# Altium project AirLP.PrjPcb
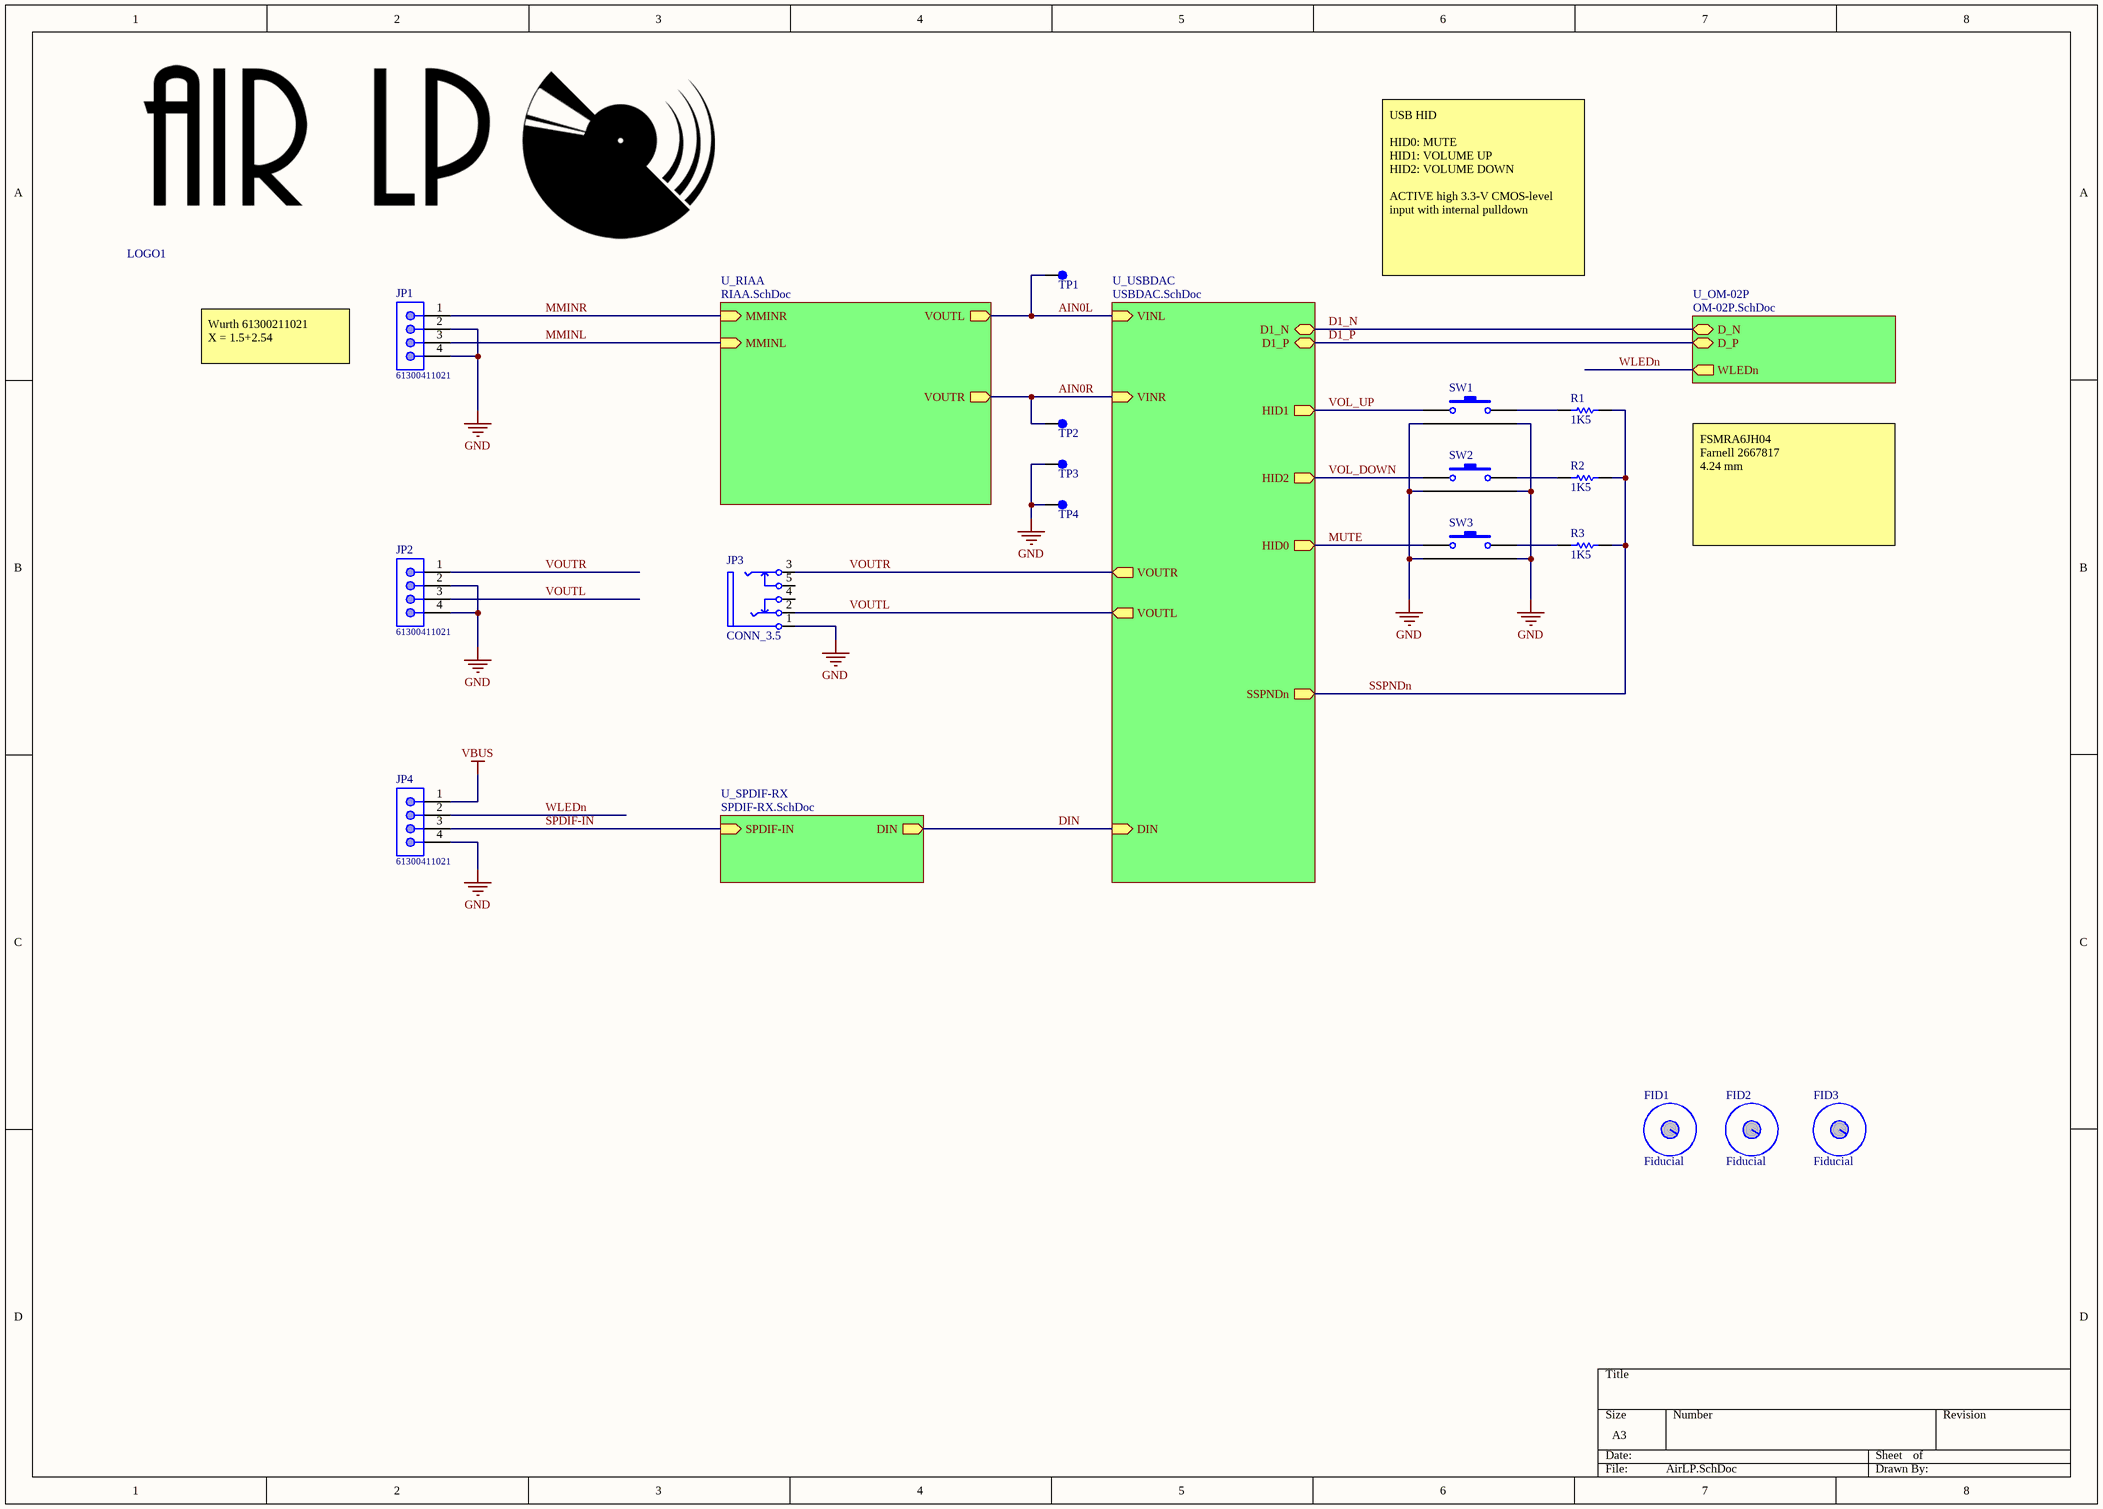
[diagram p0: AirLP.SchDoc]
5 sheets, 142 parts. Net scope: hierarchical (ports join the sheet entries above them; power ports are global).
Board file: AirLP.PcbDoc
Sheets:
  AirLP.SchDoc
    U_RIAA = RIAA.SchDoc
    U_USBDAC = USBDAC.SchDoc
    U_OM-02P = OM-02P.SchDoc
    U_SPDIF-RX = SPDIF-RX.SchDoc

## Sheet AirLP.SchDoc
size A3

### Parts
FID1  Fiducial  [MECH_FID_PLUS]  (no BOM)
FID2  Fiducial  [MECH_FID_PLUS]  (no BOM)
FID3  Fiducial  [MECH_FID_PLUS]  (no BOM)
JP1  61300411021  [61300411021]
JP2  61300411021  [61300411021]
JP3  CONN_3.5  [CONN-3.5_LUMBERG_1503_09]
JP4  61300411021  [61300411021]
LOGO1  LOGO-AIRLP  [LOGO-AIR-LP]  (value not drawn)  (no BOM)
R1  1K5  [RESC0805(2012)_L]
R2  1K5  [RESC0805(2012)_L]
R3  1K5  [RESC0805(2012)_L]
SW1  SW_TACT_FSMRA2JH  [SW_FSMRA2JH]  (value not drawn)
SW2  SW_TACT_FSMRA2JH  [SW_FSMRA2JH]  (value not drawn)
SW3  SW_TACT_FSMRA2JH  [SW_FSMRA2JH]  (value not drawn)
TP1  MECH_Testpoint  [MECH_TP_39_mil]  (value not drawn)  (no BOM)
TP2  MECH_Testpoint  [MECH_TP_39_mil]  (value not drawn)  (no BOM)
TP3  MECH_Testpoint  [MECH_TP_39_mil]  (value not drawn)  (no BOM)
TP4  MECH_Testpoint  [MECH_TP_39_mil]  (value not drawn)  (no BOM)

### Sub-sheets
U_OM-02P = OM-02P.SchDoc: D_P (bidir), D_N (bidir), WLEDn (out)
U_RIAA = RIAA.SchDoc: MMINL (in), MMINR (in), VOUTL (out), VOUTR (out)
U_SPDIF-RX = SPDIF-RX.SchDoc: SPDIF-IN (in), DIN (out)
U_USBDAC = USBDAC.SchDoc: VINL (in), VINR (in), VOUTL (out), VOUTR (out), SSPNDn (out), D1_P (bidir), D1_N (bidir), HID0 (out), HID1 (out), HID2 (out), DIN (in)

### Nets
GND: JP1.2 JP1.4 JP2.2 JP2.4 JP3.1(S) JP4.4 SW1.3 SW1.4 SW2.3 SW2.4 SW3.3 SW3.4 TP3.1(Pin1) TP4.1(Pin1)
VBUS: JP4.1
AIN0L: TP1.1(Pin1) ; sheet U_RIAA/VOUTL, sheet U_USBDAC/VINL
AIN0R: TP2.1(Pin1) ; sheet U_RIAA/VOUTR, sheet U_USBDAC/VINR
D1_N: sheet U_USBDAC/D1_N, sheet U_OM-02P/D_N
D1_P: sheet U_USBDAC/D1_P, sheet U_OM-02P/D_P
DIN: sheet U_USBDAC/DIN, sheet U_SPDIF-RX/DIN
MMINL: JP1.3 ; sheet U_RIAA/MMINL
MMINR: JP1.1 ; sheet U_RIAA/MMINR
MUTE: SW3.1 ; sheet U_USBDAC/HID0
SPDIF-IN: JP4.3 ; sheet U_SPDIF-RX/SPDIF-IN
SSPNDn: R1.2 R2.2 R3.2 ; sheet U_USBDAC/SSPNDn
VOL_DOWN: SW2.1 ; sheet U_USBDAC/HID2
VOL_UP: SW1.1 ; sheet U_USBDAC/HID1
VOUTL: JP2.3 JP3.2(T) ; sheet U_USBDAC/VOUTL
VOUTR: JP2.1 JP3.3(RN) ; sheet U_USBDAC/VOUTR
WLEDn: JP4.2 ; sheet U_OM-02P/WLEDn
NetR1_1: R1.1 SW1.2
NetR2_1: R2.1 SW2.2
NetR3_1: R3.1 SW3.2

Not connected (* = marked no-connect by the designer): JP3 4 5

### Notes on the sheet
- USB HID
  HID0:	MUTE
  HID1:	VOLUME UP
  HID2:	VOLUME DOWN
  ACTIVE high 3.3-V CMOS-level input with internal pulldown
- Wurth 61300211021
  X = 1.5+2.54
- FSMRA6JH04
  Farnell 2667817
  4.24 mm

### Library data of the parts
FID1-FID3 = MECH_FIDUCIAL_PLUS
JP1 JP2 JP4 = 61300411021: THT Angled Pin Header WR-PHD, Pitch 2.54 mm, Single Row, 4 pins; Pin Number: 4; Pitch: 2.54 mm; Gender: Male; Rated Current: 3 A; Working Voltage: 250 VAC; Withstanding Voltage: 500 VAC; Contact Resistance: 20 mOhm; ComponentLink1Description: Manufacturer; ComponentLink1URL: http://www.we-online.de; ComponentLink2Description: Datasheet; ComponentLink2URL: https://katalog.we-online.de/em/datasheet/6130xx11021.pdf; Part Number: 61300411021; Published Date: August 2018; Publisher: Wurth Elektronik; Operating Temperature: -40 to 105 degC; Mounting Technology: THT; Packaging: Bag; Row Number: Single; Orientation: Angled; MPN: 61300411021
JP3 = CONN_3.5_1503_09: Jack Socket, 3.5mm, Thru-Hole, Horizontal, 3-Conductor with Tip open & Ring closed; MPN: 1503 09; ELFA: 300-68-357; Farnell: 1243244
LOGO1 = LOGO-AIRLP: LOGO AIR LP
R1-R3 = RES_1K5_0805: 0805 1.5KΩ ±5% 1/8W; MPN: RC0805JR-071K5L; Power: 125mW; Tolerance: 5%; Value: 1K5
SW1-SW3 = SW_TACT_FSMRA2JH: SWITCH TACTILE SPST-NO 0.05A 12V; ELFA: 35-665-57; DigiKey: 450-1662-ND; Farnell: 1555987; MPN: FSMRA2JH
TP1-TP4 = MECH_Testpoint: Testpoint

## Sheet RIAA.SchDoc
size A3
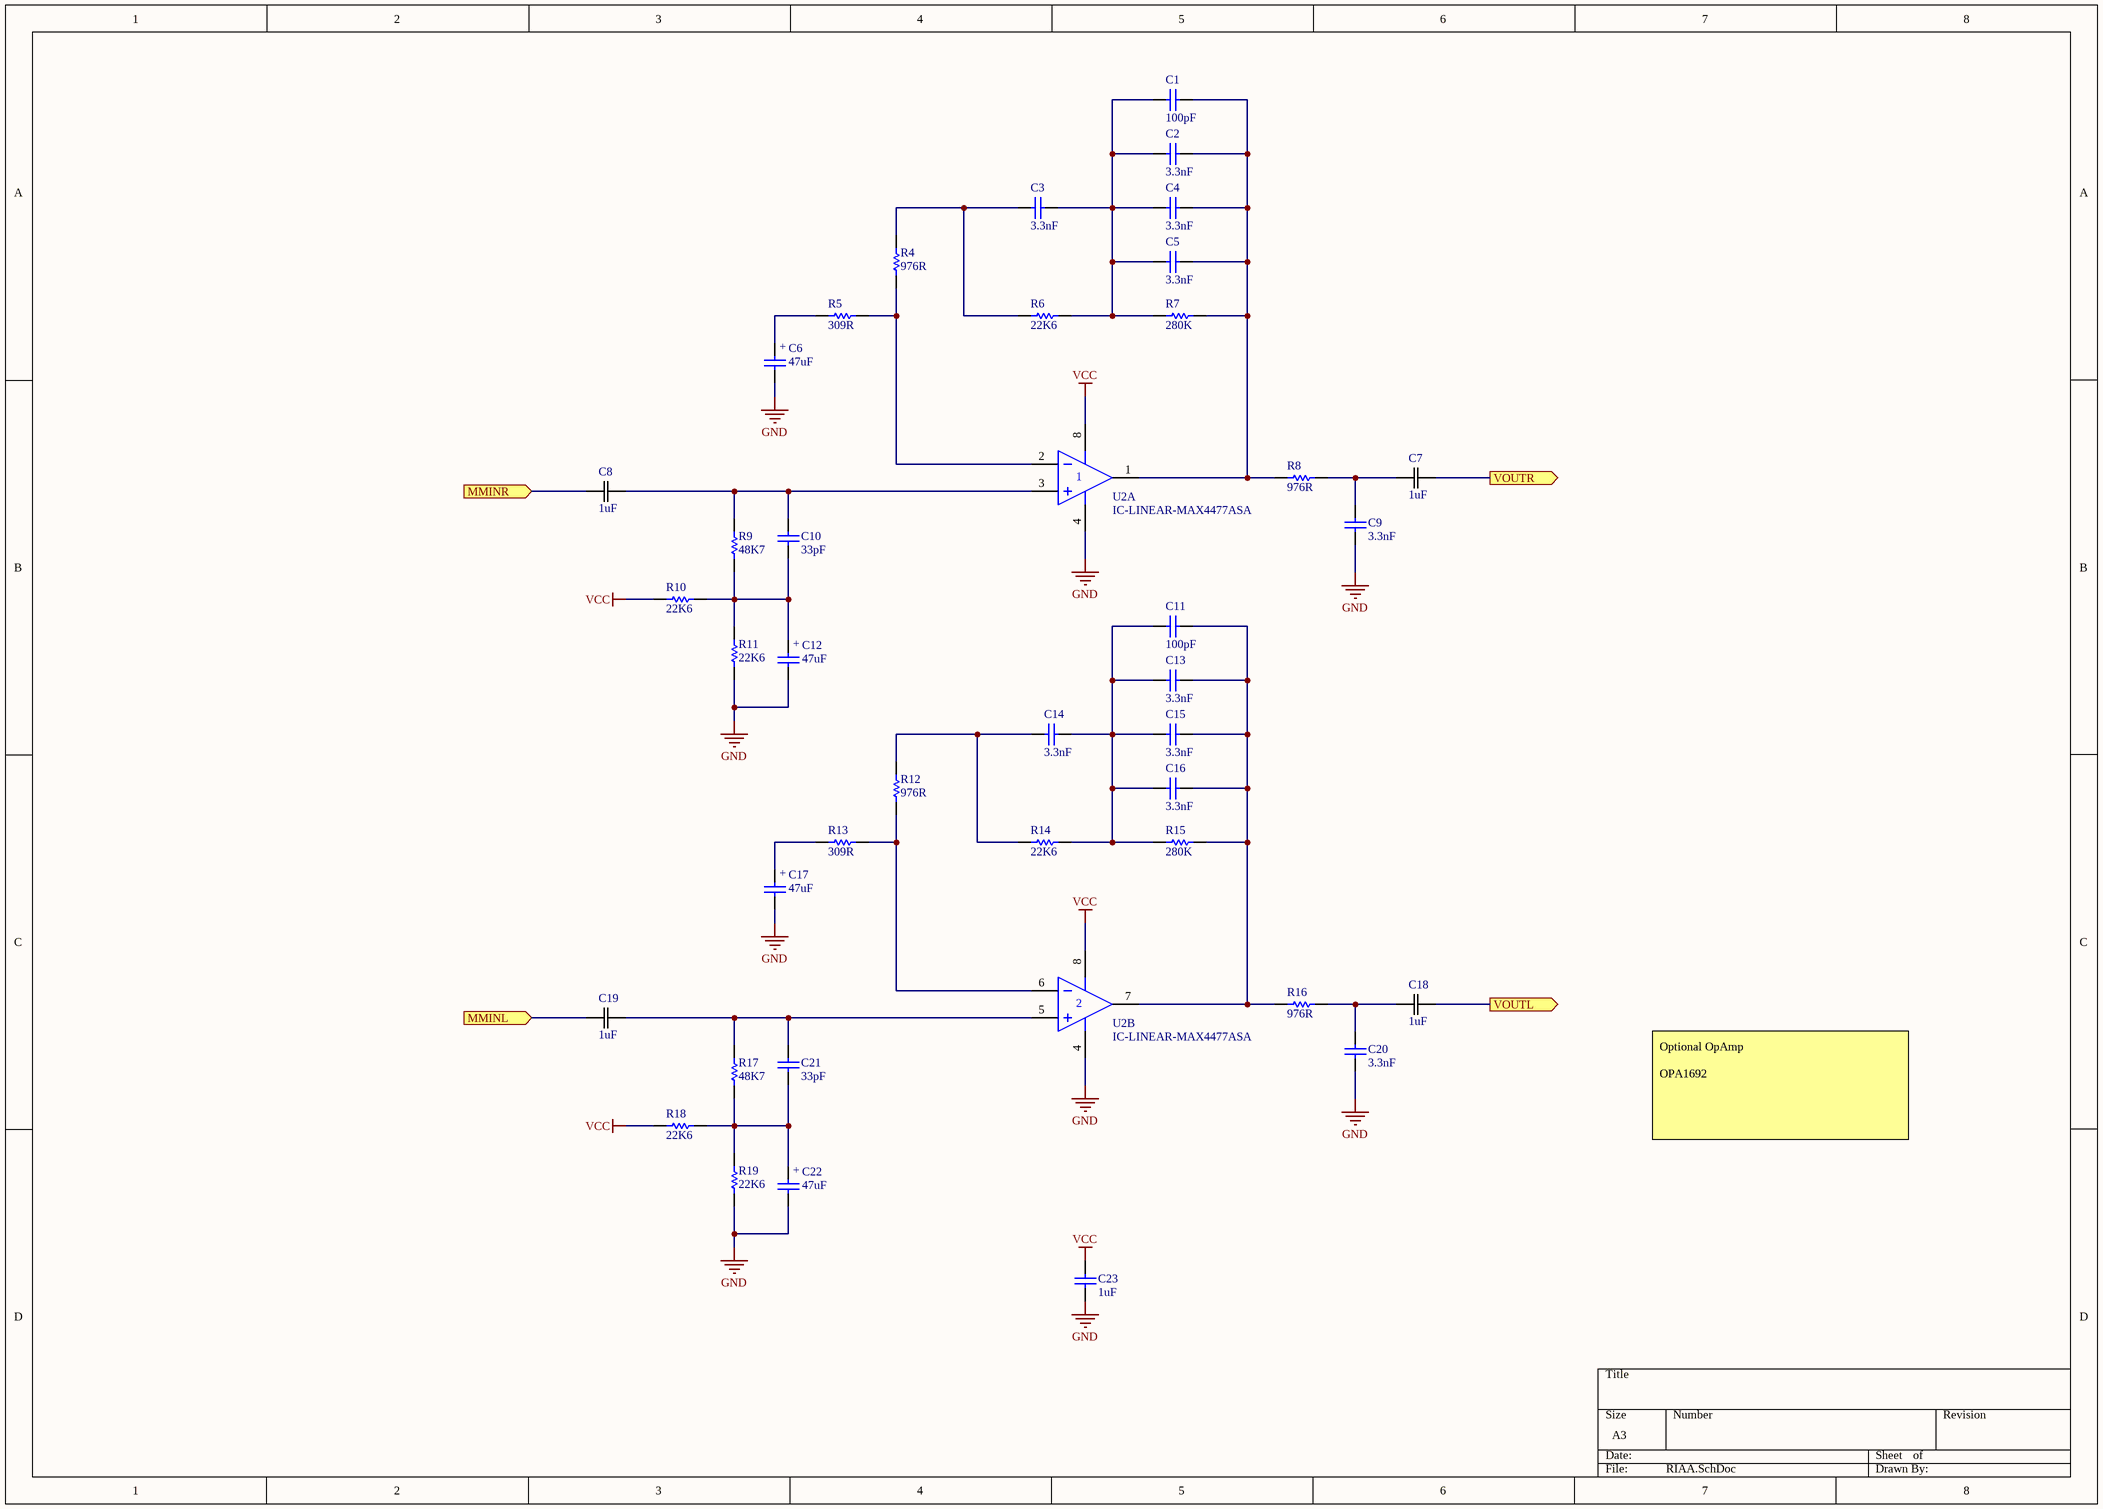
[diagram p1: RIAA.SchDoc]

### Parts
C1  value 100pF  [CAPC0402(1005)33_L]  (hidden comment: 0402CG101J500NT)
C2  value 3.3nF  [CAPC0603(1608)55_L]  (hidden comment: CL10C332JB8NFNC)
C3  value 3.3nF  [CAPC0603(1608)55_L]  (hidden comment: CL10C332JB8NFNC)
C4  value 3.3nF  [CAPC0603(1608)55_L]  (hidden comment: CL10C332JB8NFNC)
C5  value 3.3nF  [CAPC0603(1608)55_L]  (hidden comment: CL10C332JB8NFNC)
C6  value 47uF  [CAPPM3216X180N]  (hidden comment: TAJA476K006RNJ)
C7  1uF  [CAP_ECPU_G2]
C8  1uF  [CAP_ECPU_G2]
C9  value 3.3nF  [CAPC0603(1608)55_L]  (hidden comment: CL10C332JB8NFNC)
C10  value 33pF  [CAPC0402(1005)33_L]  (hidden comment: CC0402JRNPO9BN330)
C11  value 100pF  [CAPC0402(1005)33_L]  (hidden comment: 0402CG101J500NT)
C12  value 47uF  [CAPPM3216X180N]  (hidden comment: TAJA476K006RNJ)
C13  value 3.3nF  [CAPC0603(1608)55_L]  (hidden comment: CL10C332JB8NFNC)
C14  value 3.3nF  [CAPC0603(1608)55_L]  (hidden comment: CL10C332JB8NFNC)
C15  value 3.3nF  [CAPC0603(1608)55_L]  (hidden comment: CL10C332JB8NFNC)
C16  value 3.3nF  [CAPC0603(1608)55_L]  (hidden comment: CL10C332JB8NFNC)
C17  value 47uF  [CAPPM3216X180N]  (hidden comment: TAJA476K006RNJ)
C18  1uF  [CAP_ECPU_G2]
C19  1uF  [CAP_ECPU_G2]
C20  value 3.3nF  [CAPC0603(1608)55_L]  (hidden comment: CL10C332JB8NFNC)
C21  value 33pF  [CAPC0402(1005)33_L]  (hidden comment: CC0402JRNPO9BN330)
C22  value 47uF  [CAPPM3216X180N]  (hidden comment: TAJA476K006RNJ)
C23  value 1uF  [CAPC0402(1005)33_L]  (hidden comment: GRM155R61C105KA12D)
R4  976R  [RESC0402(1005)_L]
R5  309R  [RESC0402(1005)_L]
R6  22K6  [RESC0402(1005)_L]
R7  280K  [RESC0402(1005)_L]
R8  976R  [RESC0402(1005)_L]
R9  48K7  [RESC0402(1005)_L]
R10  22K6  [RESC0402(1005)_L]
R11  22K6  [RESC0402(1005)_L]
R12  976R  [RESC0402(1005)_L]
R13  309R  [RESC0402(1005)_L]
R14  22K6  [RESC0402(1005)_L]
R15  280K  [RESC0402(1005)_L]
R16  976R  [RESC0402(1005)_L]
R17  48K7  [RESC0402(1005)_L]
R18  22K6  [RESC0402(1005)_L]
R19  22K6  [RESC0402(1005)_L]
U2  IC-LINEAR-MAX4477ASA  [SOIC8_N]  (parts A,B of 2)

### Ports
MMINL (in), MMINR (in), VOUTL (out), VOUTR (out)

### Nets
GND: C6.2 C9.1 C12.2 C17.2 C20.1 C22.2 C23.1 R11.2 R19.2 U2.4(V-)
VCC: C23.2 R10.1 R18.1 U2.8(V+)
AIN0L: C18.2 ; port VOUTL
AIN0R: C7.2 ; port VOUTR
MMINL: C19.1 ; port MMINL
MMINR: C8.1 ; port MMINR
NetC1_1: C1.1 C2.1 C3.2 C4.1 C5.1 R6.2 R7.1
NetC1_2: C1.2 C2.2 C4.2 C5.2 R7.2 R8.1 U2.1(OUT1)
NetC3_1: C3.1 R4.1 R6.1
NetC6_1: C6.1 R5.1
NetC7_1: C7.1 C9.2 R8.2
NetC8_2: C8.2 C10.1 R9.1 U2.3(IN1+)
NetC10_2: C10.2 C12.1 R9.2 R10.2 R11.1
NetC11_1: C11.1 C13.1 C14.2 C15.1 C16.1 R14.2 R15.1
NetC11_2: C11.2 C13.2 C15.2 C16.2 R15.2 R16.1 U2.7(OUT2)
NetC14_1: C14.1 R12.1 R14.1
NetC17_1: C17.1 R13.1
NetC18_1: C18.1 C20.2 R16.2
NetC19_2: C19.2 C21.1 R17.1 U2.5(IN2+)
NetC21_2: C21.2 C22.1 R17.2 R18.2 R19.1
NetR4_2: R4.2 R5.2 U2.2(IN1-)
NetR12_2: R12.2 R13.2 U2.6(IN2-)

### Notes on the sheet
- Optional OpAmp
  OPA1692
- (in symbol CAP_47uF_6.3V_1206) +

### Library data of the parts
C1 C11 = CAP_100pF_0402: 0402 100pF ±5% 50V C0G，NP0; Dielectric: C0G; PackageReference: 0402; MPN: 0402CG101J500NT; Voltage: 50V
C2-C5 C9 C13-C16 C20 = CAP_3.3nF_0603: 0603 3.3nF ±5% 50V C0G(NPO) H=0.8mm; PackageReference: 0603; MPN: CL10C332JB8NFNC; Voltage: 50V; Dielectric: C0G
C6 C12 C17 C22 = CAP_47uF_6.3V_1206: 47µF ±10% 6.3V ESR=1.6Ω@100kHz; Dielectric: Tantalum; PackageReference: 1206; MPN: TAJA476K006RNJ; Voltage: 6.3V
C7 C8 C18 C19 = CAP-ECP-U1C105MA5: 1µF Film Capacitor  16V Acrylic, Metallized - Stacked 1210 (3225 Metric); Vendor: Panasonic; Built_By: EMA_UL_Team; Type: DEV; C: Copyright (C) 2015 Accelerated Designs. All rights reserved; MPN: ECP-U1C105MA5; RefDes: RefDes; Value: 1uF
C10 C21 = CAP_33pF_0402: 0402 33PF ±5% 50V NPO; Dielectric: C0G; PackageReference: 0402; MPN: CC0402JRNPO9BN330; Voltage: 50V
C23 = CAP_1uF_0402: 0402 1μF ±10% 16V X5R; Voltage: 10V; PackageReference: 0402; MPN: GRM155R61C105KA12D; Dielectric: X5R
R4 R8 R12 R16 = RES_976R_0402: 0402 976Ω ±1% 1/16W; MPN: 0402WGF9760TCE; Power: 62.5mW; Tolerance: 1%; Value: 976R
R5 R13 = RES_309R_0402: 0402 309Ω ±1% 1/16W; MPN: 0402WGF3090TCE; Power: 62.5mW; Tolerance: 1%; Value: 309R
R6 R10 R11 R14 R18 R19 = RES_22K6_0402: 0402 22.6KΩ ±1% 1/16W; MPN: RC0402FR-0722K6L; Power: 62.5mW; Tolerance: 1%; Value: 22K6
R7 R15 = RES_280K_0402: 0402 280KΩ ±1% 1/16W; MPN: 0402WGF2803TCE; Power: 62.5mW; Tolerance: 1%; Value: 280K
R9 R17 = RES_48K7_0402: 0402 48.7KΩ ±1% 1/16W; MPN: 0402WGF4872TCE; Power: 62.5mW; Tolerance: 1%; Value: 48K7
U2 = IC-LINEAR-MAX4477ASA: Dual Rail-to-Rail output  Low-Power Operational Amplifier; MPN: MAX4477ASA+; Farnell: 1550527

## Sheet USBDAC.SchDoc
size A3
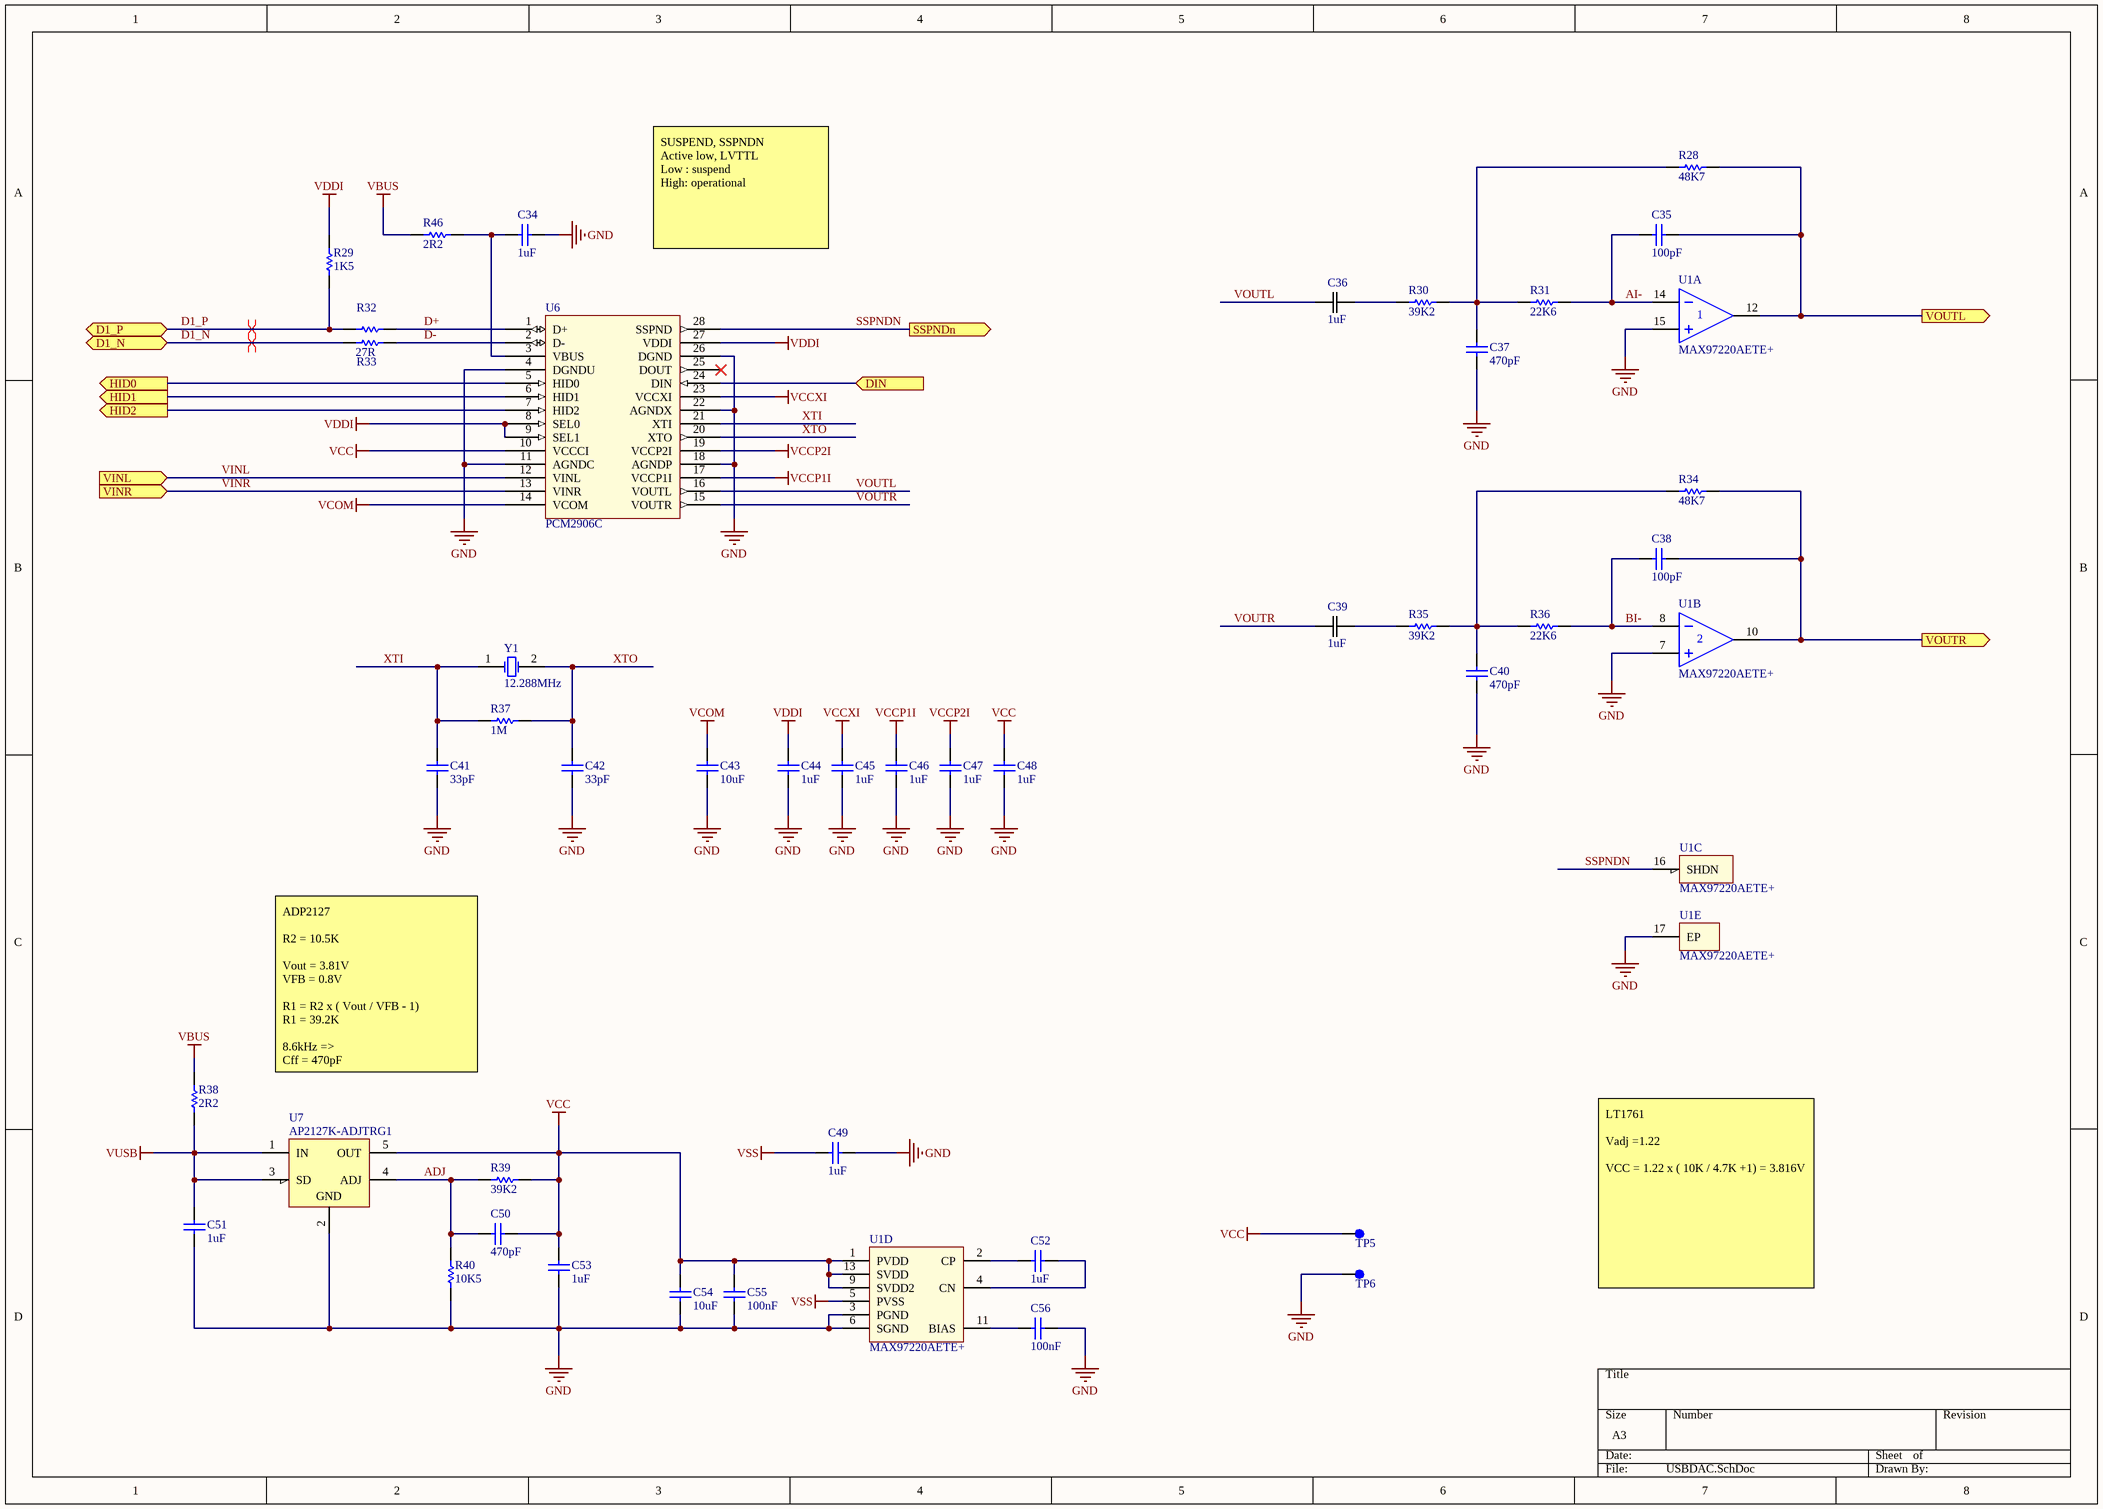
[diagram p2: USBDAC.SchDoc]

### Parts
C34  value 1uF  [CAPC0402(1005)33_L]  (hidden comment: GRM155R61C105KA12D)
C35  value 100pF  [CAPC0402(1005)33_L]  (hidden comment: 0402CG101J500NT)
C36  1uF  [CAP_ECPU_G2]
C37  value 470pF  [CAPC0402(1005)33_L]  (hidden comment: GRM1555C1H471JA01D)
C38  value 100pF  [CAPC0402(1005)33_L]  (hidden comment: 0402CG101J500NT)
C39  1uF  [CAP_ECPU_G2]
C40  value 470pF  [CAPC0402(1005)33_L]  (hidden comment: GRM1555C1H471JA01D)
C41  value 33pF  [CAPC0402(1005)33_L]  (hidden comment: CC0402JRNPO9BN330)
C42  value 33pF  [CAPC0402(1005)33_L]  (hidden comment: CC0402JRNPO9BN330)
C43  value 10uF  [CAPC0603(1608)55_L]  (hidden comment: CL10A106MQ8NNNC)
C44  value 1uF  [CAPC0402(1005)33_L]  (hidden comment: GRM155R61C105KA12D)
C45  value 1uF  [CAPC0402(1005)33_L]  (hidden comment: GRM155R61C105KA12D)
C46  value 1uF  [CAPC0402(1005)33_L]  (hidden comment: GRM155R61C105KA12D)
C47  value 1uF  [CAPC0402(1005)33_L]  (hidden comment: GRM155R61C105KA12D)
C48  value 1uF  [CAPC0402(1005)33_L]  (hidden comment: GRM155R61C105KA12D)
C49  value 1uF  [CAPC0402(1005)33_L]  (hidden comment: GRM155R61C105KA12D)
C50  value 470pF  [CAPC0402(1005)33_L]  (hidden comment: GRM1555C1H471JA01D)
C51  value 1uF  [CAPC0402(1005)33_L]  (hidden comment: GRM155R61C105KA12D)
C52  value 1uF  [CAPC0402(1005)33_L]  (hidden comment: GRM155R61C105KA12D)
C53  value 1uF  [CAPC0402(1005)33_L]  (hidden comment: GRM155R61C105KA12D)
C54  value 10uF  [CAPC0603(1608)55_L]  (hidden comment: CL10A106MQ8NNNC)
C55  value 100nF  [CAPC0402(1005)33_L]  (hidden comment: GRM155R61C104KA88D)
C56  value 100nF  [CAPC0402(1005)33_L]  (hidden comment: GRM155R61C104KA88D)
R28  48K7  [RESC0402(1005)_L]
R29  1K5  [RESC0805(2012)_L]
R30  39K2  [RESC0402(1005)_L]
R31  22K6  [RESC0402(1005)_L]
R32  27R  [RESC0402(1005)_L]  (value not drawn)
R33  27R  [RESC0402(1005)_L]
R34  48K7  [RESC0402(1005)_L]
R35  39K2  [RESC0402(1005)_L]
R36  22K6  [RESC0402(1005)_L]
R37  1M  [RESC0402(1005)_L]
R38  2R2  [RESC0402(1005)_L]
R39  39K2  [RESC0402(1005)_L]
R40  10K5  [RESC0402(1005)_L]
R46  2R2  [RESC0402(1005)_L]
TP5  MECH_Testpoint  [MECH_TP_39_mil]  (value not drawn)  (no BOM)
TP6  MECH_Testpoint  [MECH_TP_39_mil]  (value not drawn)  (no BOM)
U1  MAX97220AETE+  [21-0136I_T1633-4]  (parts A,B,C,D,E of 5)
U6  PCM2906C  [SSOP28_N]
U7  AP2127K-ADJTRG1  [DCK0005A_L]
Y1  value 12.288MHz  [XTAL_SMD_5.0x3.2]  (hidden comment: ABM3-12.288MHZ-D2Y-T)

### Ports
D1_N (bidir), D1_P (bidir), DIN (in), HID0 (out), HID1 (out), HID2 (out), SSPNDn (out), VINL (in), VINR (in), VOUTL (out), VOUTR (out)

### Nets
GND: C34.1 C37.1 C40.1 C41.1 C42.1 C43.1 C44.1 C45.1 C46.1 C47.1 C48.1 C49.1 C51.1 C53.1 C54.1 C55.1 C56.2 R40.1 TP6.1(Pin1) U1.3(PGND) U1.6(SGND) U1.7(IN2+) U1.15(IN1+) U1.17(EP) U6.4(DGNDU) U6.11(AGNDC) U6.18(AGNDP) U6.22(AGNDX) U6.26(DGND) U7.2(GND)
VBUS: R38.2 R46.2
VCC: C48.2 C50.2 C53.2 C54.2 C55.2 R39.2 TP5.1(Pin1) U1.1(PVDD) U1.9(SVDD2) U1.13(SVDD) U6.10(VCCCI) U7.5(OUT)
VCCP1I: C46.2 U6.17(VCCP1I)
VCCP2I: C47.2 U6.19(VCCP2I)
VCCXI: C45.2 U6.23(VCCXI)
VCOM: C43.2 U6.14(VCOM)
VDDI: C44.2 R29.2 U6.8(SEL0) U6.9(SEL1) U6.27(VDDI)
VSS: C49.2 U1.5(PVSS)
VUSB: C51.2 R38.1 U7.1(IN) U7.3(SD)
ADJ: C50.1 R39.1 R40.2 U7.4(ADJ)
AI-: C35.1 R31.2 U1.14(IN1-)
BI-: C38.1 R36.2 U1.8(IN2-)
D1_N: R33.1 ; port D1_N
D1_P: R29.1 R32.1 ; port D1_P
D+: R32.2 U6.1(D+)
D-: R33.2 U6.2(D-)
DIN: U6.24(DIN) ; port DIN
MUTE: U6.5(HID0) ; port HID0
SSPNDn: U1.16(SHDN) U6.28(SSPND) ; port SSPNDn
VINL: U6.12(VINL) ; port VINL  [project net AIN0L]
VINR: U6.13(VINR) ; port VINR  [project net AIN0R]
VOL_DOWN: U6.7(HID2) ; port HID2
VOL_UP: U6.6(HID1) ; port HID1
VOUTL: C35.2 R28.2 U1.12(OUT1) ; port VOUTL
VOUTL: C36.1 U6.16(VOUTL)  [a separate net that carries the same name]
VOUTR: C38.2 R34.2 U1.10(OUT2) ; port VOUTR
VOUTR: C39.1 U6.15(VOUTR)  [a separate net that carries the same name]
XTI: C41.2 R37.1 U6.21(XTI) Y1.1(OSC1)
XTO: C42.2 R37.2 U6.20(XTO) Y1.2(OSC2)
NetC34_2: C34.2 R46.1 U6.3(VBUS)
NetC36_2: C36.2 R30.1
NetC37_2: C37.2 R28.1 R30.2 R31.1
NetC39_2: C39.2 R35.1
NetC40_2: C40.2 R34.1 R35.2 R36.1
NetC52_1: C52.1 U1.4(CN)
NetC52_2: C52.2 U1.2(CP)
NetC56_1: C56.1 U1.11(BIAS)

Not connected (* = marked no-connect by the designer): U6 25(DOUT)*

### Layout directives
differential pair: D1_N, D1_P

### Notes on the sheet
- SUSPEND, SSPNDN
  Active low, LVTTL
  Low : suspend
  High: operational
- ADP2127
  R2 = 10.5K
  Vout = 3.81V
  VFB = 0.8V
  R1 = R2 x ( Vout / VFB - 1)
  R1 = 39.2K
  8.6kHz =>
  Cff = 470pF
- LT1761
  Vadj =1.22
  VCC = 1.22 x ( 10K / 4.7K +1) = 3.816V

### Library data of the parts
C34 C44-C49 C51-C53 = CAP_1uF_0402: 0402 1μF ±10% 16V X5R; Voltage: 10V; PackageReference: 0402; MPN: GRM155R61C105KA12D; Dielectric: X5R
C35 C38 = CAP_100pF_0402: as C1 on sheet RIAA; PackageReference: 0402; MPN: 0402CG101J500NT; Voltage: 50V
C36 C39 = CAP-ECP-U1C105MA5: as C7 on sheet RIAA; MPN: ECP-U1C105MA5; RefDes: RefDes; Value: 1uF
C37 C40 C50 = CAP_470pF_0402: 0402 470pF ±5% 50V C0G; PackageReference: 0402; MPN: GRM1555C1H471JA01D; Voltage: 50V; Dielectric: C0G
C41 C42 = CAP_33pF_0402: 0402 33PF ±5% 50V NPO; Dielectric: C0G; PackageReference: 0402; MPN: CC0402JRNPO9BN330; Voltage: 50V
C43 C54 = CAP_10uF_0603: 0603 10uF ±20% 6.3V X5R H=0.8mm; Voltage: 10V; PackageReference: 0603; MPN: CL10A106MQ8NNNC; Dielectric: X5R
C55 C56 = CAP_100nF_0402: 0402 100nF ±10% 16V X5R; PackageReference: 0402; MPN: GRM155R61C104KA88D; Voltage: 16V; Dielectric: X5R
R28 R34 = RES_48K7_0402: as R9 on sheet RIAA; Tolerance: 1%; Value: 48K7
R29 = RES_1K5_0805: as R1 on sheet AirLP; Tolerance: 5%; Value: 1K5
R30 R35 R39 = RES_39K2_0402: 0402 39.2KΩ ±1% 1/16W; MPN: RC0402FR-0739K2L; Power: 62.5mW; Tolerance: 1%; Value: 39K2
R31 R36 = RES_22K6_0402: as R6 on sheet RIAA; Tolerance: 1%; Value: 22K6
R32 R33 = RES_27R_0402: 0402 27Ω ±1% 1/16W; MPN: RC0402FR-0727RL; Power: 62.5mW; Tolerance: 1%; Value: 27R
R37 = RES_1M_0402: 0402 1MΩ ±1% 1/16W; MPN: RC0402FR-071ML; Power: 62.5mW; Tolerance: 1%; Value: 1M
R38 R46 = RES_2R2_0402: 0402 2.2Ω ±1% 1/16W; MPN: 0402WGF220KTCE; Power: 62.5mW; Tolerance: 1%; Value: 2R2
R40 = RES_10K5_0402: 0402 10.5KΩ ±1% 1/16W; MPN: RC0402FR-0710K5L; Power: 62.5mW; Tolerance: 1%; Value: 10K5
TP5 TP6 = MECH_Testpoint: Testpoint
U1 = MAX97220AETE+: Differential Input DirectDrive Line Drivers/Headphone Amplifiers; MPN: MAX97220AETE+T; Farnell: 2516953; DigiKey: MAX97220AETE+TCT-ND
U6 = IC-AUDIO-PCM2906C: IC STEREO AUD CODEC W/USB 28SSOP; MPN: PCM2906CDB
U7 = AP2127K-ADJTRG1: 300mA HIGH SPEED, EXTREMELY LOW NOISE CMOS LDO REGULATOR; Manufacturer: Diodes Inc; Vin(Max)(V): 5.5; Iq(Typ)(mA): 0.06; Vdo(Typ)(mV): 170; Vout Adj(Min)(V): 0.8; Eco-Plan: Green (RoHS & no Sb/Br); Accuracy(%): 2; Iout(Max)(A): 0.3; Vout Adj(Max)(V): 5.0; Vin(Min)(V): 2.5; SubFamily: Single Channel LDO; PackageVersion: 4093553-3/G; Code_JEDEC: MO-203; ComponentLink2Description: Datasheet; ComponentLink1URL: http://www.ti.com/; ComponentLink3Description: Package Specification; ComponentLink2URL: http://www.ti.com/general/docs/lit/getliterature.tsp?genericPartNumber=TPS71701&fileType=pdf; MPN: AP2127K-ADJTRG1; Mounting Technology: Surface Mount; ComponentLink1Description: Manufacturer URL; ComponentLink3URL: http://www.ti.com/litv/pdf/mpds025f; PackageDescription: 5-Pin Plastic Small-Outline, Body 2 x 1.25 mm, Pitch 0.65 mm; PackageReference: DCK0005A
Y1 = XTAL_12.288MHz_ABM3-12.288MHZ-D2Y-T: CRYSTAL 12.288MHZ 18PF SMD; Farnell: 1368769; MPN: ABM3-12.288MHZ-D2Y-T; DigiKey: 535-10635-1-ND

## Sheet OM-02P.SchDoc
size A3
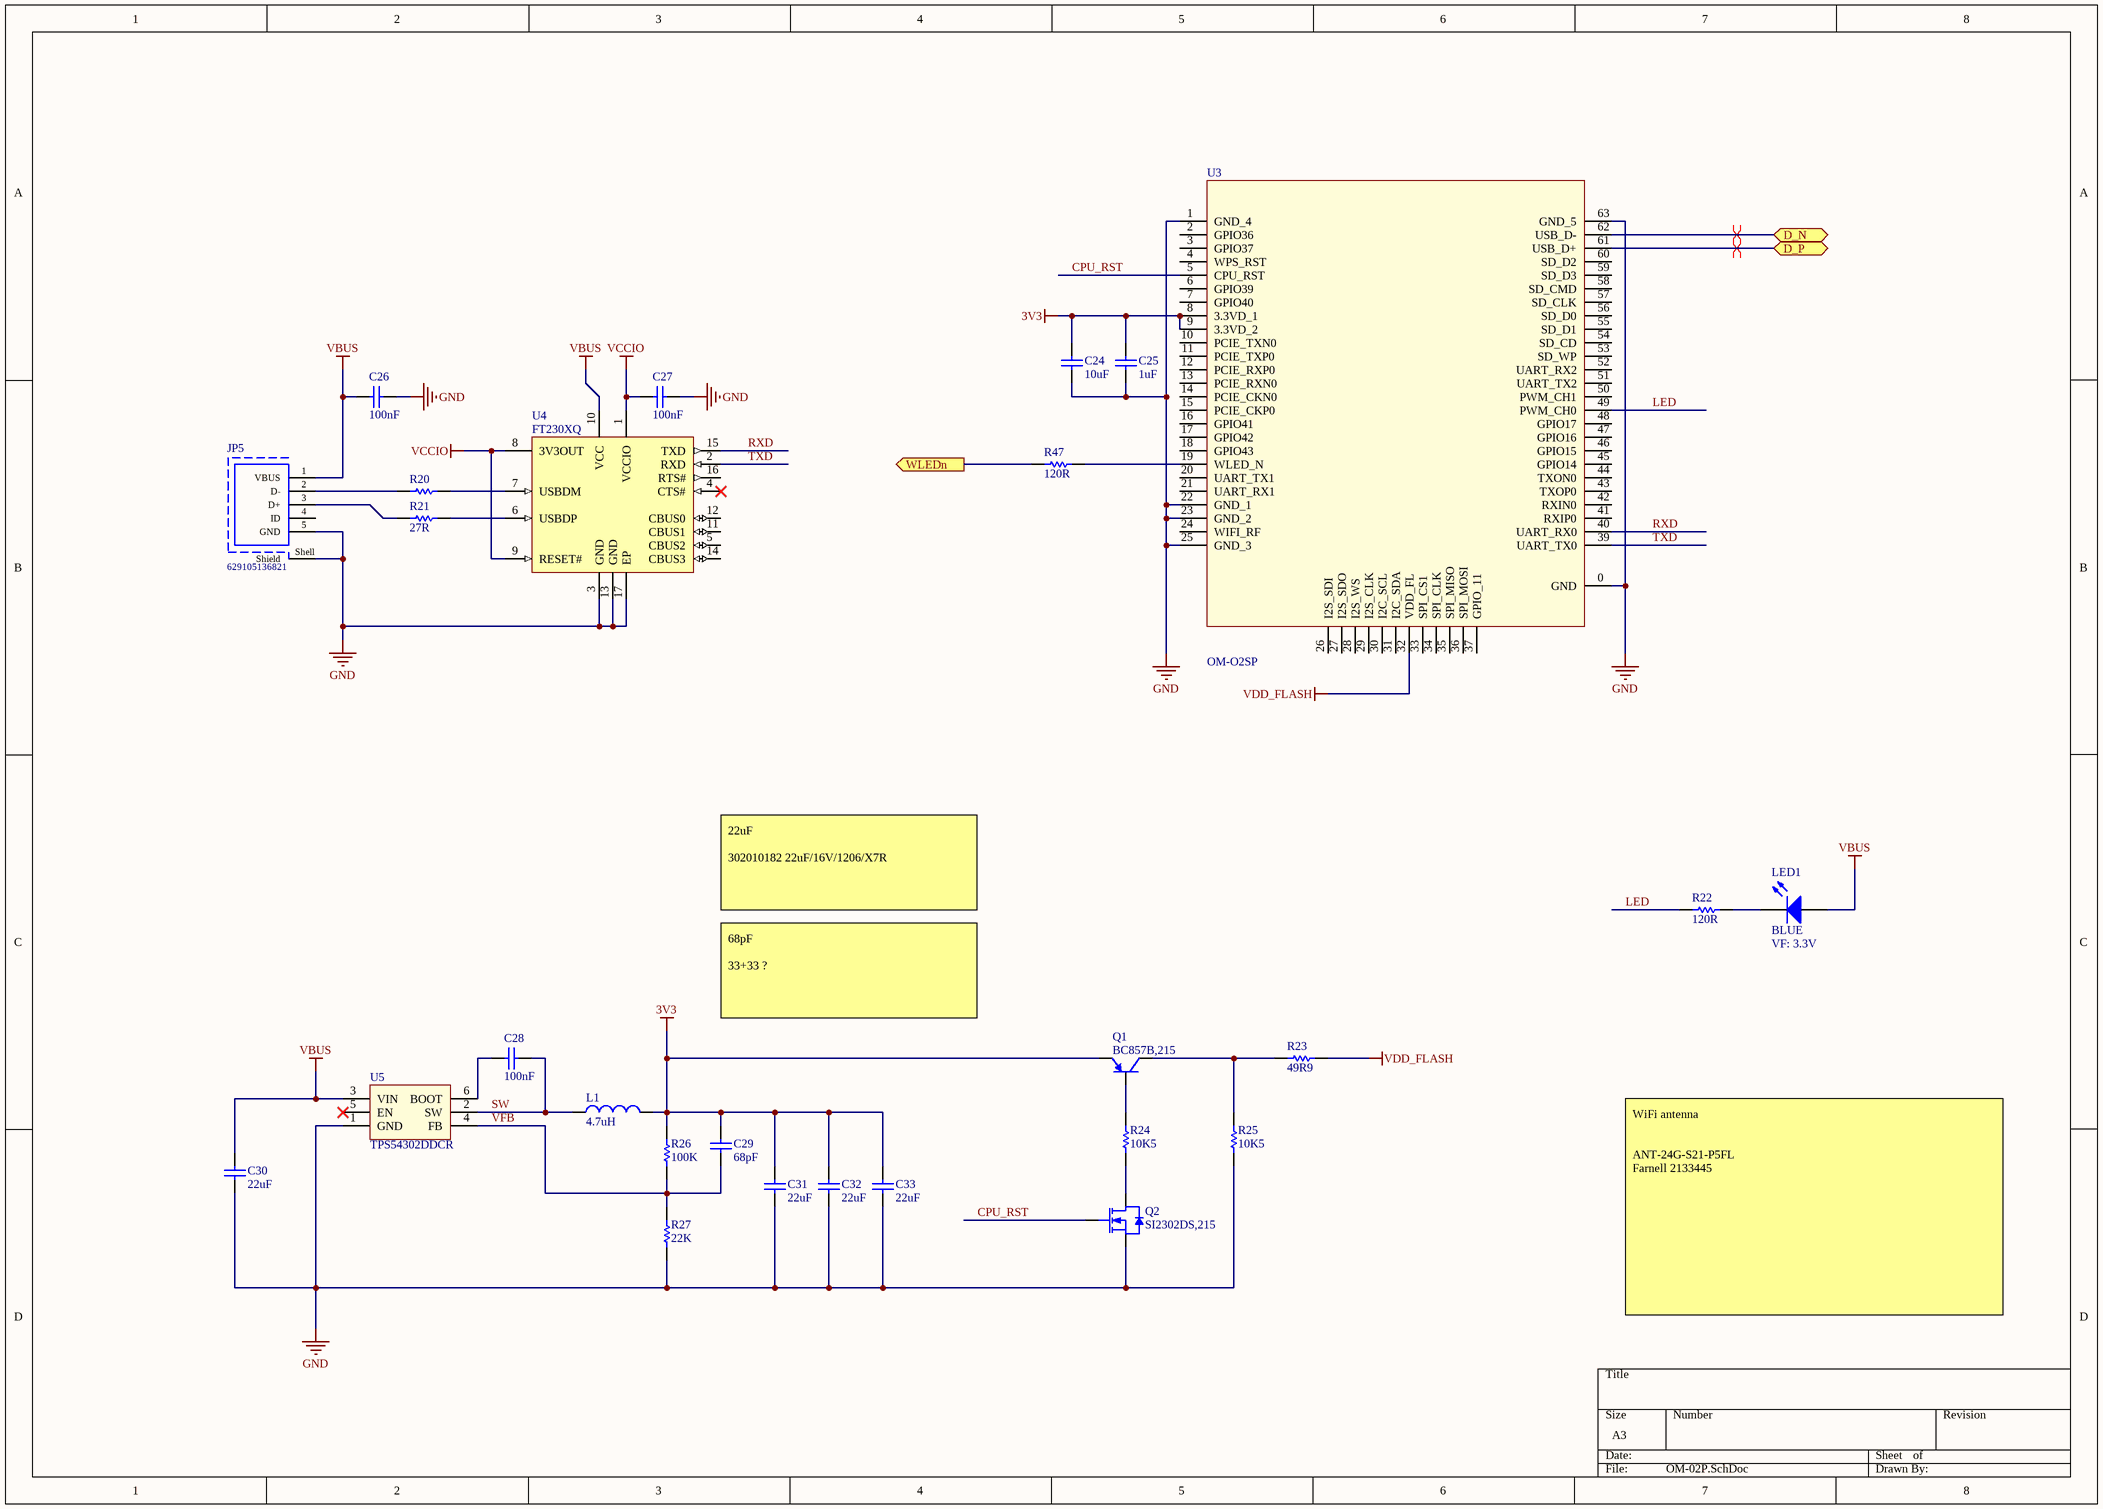
[diagram p3: OM-02P.SchDoc]

### Parts
C24  value 10uF  [CAPC0603(1608)55_L]  (hidden comment: CL10A106MQ8NNNC)
C25  value 1uF  [CAPC0402(1005)33_L]  (hidden comment: GRM155R61C105KA12D)
C26  value 100nF  [CAPC0402(1005)33_L]  (hidden comment: GRM155R61C104KA88D)
C27  value 100nF  [CAPC0402(1005)33_L]  (hidden comment: GRM155R61C104KA88D)
C28  value 100nF  [CAPC0402(1005)33_L]  (hidden comment: GRM155R61C104KA88D)
C29  value 68pF  [CAPC0402(1005)33_L]  (hidden comment: GRM1555C1H680JA01D)
C30  value 22uF  [CAPC1206(3216)75_L]  (hidden comment: CL31A226KOHNNNE)
C31  value 22uF  [CAPC1206(3216)75_L]  (hidden comment: CL31A226KOHNNNE)
C32  value 22uF  [CAPC1206(3216)75_L]  (hidden comment: CL31A226KOHNNNE)
C33  value 22uF  [CAPC1206(3216)75_L]  (hidden comment: CL31A226KOHNNNE)
JP5  629105136821  [629105136821]
L1  value 4.7uH  [L_6045]  (hidden comment: SWPA6045S4R7MT)
LED1  BLUE  VF: 3.3V  [LED_APA3010x]
Q1  BC857B,215  [NXP-SOT23_L]
Q2  SI2302DS,215  [NXP-SOT23_L]
R20  27R  [RESC0402(1005)_L]  (value not drawn)
R21  27R  [RESC0402(1005)_L]
R22  120R  [RESC0402(1005)_L]
R23  49R9  [RESC0402(1005)_L]
R24  10K5  [RESC0402(1005)_L]
R25  10K5  [RESC0402(1005)_L]
R26  100K  [RESC0402(1005)_L]
R27  22K  [RESC0402(1005)_L]
R47  120R  [RESC0402(1005)_L]
U3  OM-O2SP  [CPU-OM-O2S]
U4  FT230XQ  [QFN-16_N]
U5  TPS54302DDCR  [FAIR-MA06A_V]

### Ports
D_N (bidir), D_P (bidir), WLEDn (out)

### Nets
3V3: C24.2 C25.2 C29.2 C31.2 C32.2 C33.2 L1.2 Q1.2(E) R26.2 U3.8(3.3VD_1) U3.9(3.3VD_2)
GND: C24.1 C25.1 C26.2 C27.2 C30.1 C31.1 C32.1 C33.1 JP5.5(GND) JP5.Shell(Shield) Q2.2(S) R25.1 R27.1 U3.0(GND) U3.1(GND_4) U3.22(GND_1) U3.23(GND_2) U3.25(GND_3) U3.63(GND_5) U4.3(GND) U4.13(GND) U4.17(EP) U5.1(GND)
VBUS: C26.1 C30.2 JP5.1(VBUS) LED1.2(A) U4.10(VCC) U5.3(VIN)
VCCIO: C27.1 U4.1(VCCIO) U4.8(3V3OUT) U4.9(RESET#)
VDD_FLASH: R23.2 U3.32(VDD_FL)
CPU_RST: Q2.1(G) U3.5(CPU_RST)
D1_N: U3.62(USB_D-) ; port D_N
D1_P: U3.61(USB_D+) ; port D_P
LED: R22.1 U3.49(PWM_CH0)
RXD: U3.40(UART_RX0) U4.15(TXD)
SW: C28.2 L1.1 U5.2(SW)
TXD: U3.39(UART_TX0) U4.2(RXD)
VFB: C29.1 R26.1 R27.2 U5.4(FB)
WLEDn: R47.1 ; port WLEDn
NetC28_1: C28.1 U5.6(BOOT)
NetJP5_2: JP5.2(D-) R20.1
NetJP5_3: JP5.3(D+) R21.1
NetLED1_1: LED1.1(K) R22.2
NetQ1_1: Q1.1(B) R24.2
NetQ1_3: Q1.3(C) R23.1 R25.2
NetQ2_3: Q2.3(D) R24.1
NetR20_2: R20.2 U4.7(USBDM)
NetR21_2: R21.2 U4.6(USBDP)
NetR47_2: R47.2 U3.19(WLED_N)

Not connected (* = marked no-connect by the designer): JP5 4(ID); U3 2(GPIO36) 3(GPIO37) 4(WPS_RST) 6(GPIO39) 7(GPIO40) 10(PCIE_TXN0) 11(PCIE_TXP0) 12(PCIE_RXP0) 13(PCIE_RXN0) 14(PCIE_CKN0) 15(PCIE_CKP0) 16(GPIO41) 17(GPIO42) 18(GPIO43) 20(UART_TX1) 21(UART_RX1) 24(WIFI_RF) 26(I2S_SDI) 27(I2S_SDO) 28(I2S_WS) 29(I2S_CLK) 30(I2C_SCL) 31(I2C_SDA) 33(SPI_CS1) 34(SPI_CLK) 35(SPI_MISO) 36(SPI_MOSI) 37(GPIO_11) 41(RXIP0) 42(RXIN0) 43(TXOP0) 44(TXON0) 45(GPIO14) 46(GPIO15) 47(GPIO16) 48(GPIO17) 50(PWM_CH1) 51(UART_TX2) 52(UART_RX2) 53(SD_WP) 54(SD_CD) 55(SD_D1) 56(SD_D0) 57(SD_CLK) 58(SD_CMD) 59(SD_D3) 60(SD_D2); U4 4(CTS#)* 5(CBUS2) 11(CBUS1) 12(CBUS0) 14(CBUS3) 16(RTS#); U5 5(EN)*

### Layout directives
differential pair: D1_N, D1_P

### Notes on the sheet
- 22uF
  302010182 22uF/16V/1206/X7R
- 68pF
  33+33 ?
- WiFi antenna
  ANT-24G-S21-P5FL
  Farnell 2133445

### Library data of the parts
C24 = CAP_10uF_0603: as C43 on sheet USBDAC; PackageReference: 0603; MPN: CL10A106MQ8NNNC; Dielectric: X5R
C25 = CAP_1uF_0402: 0402 1μF ±10% 16V X5R; Voltage: 10V; PackageReference: 0402; MPN: GRM155R61C105KA12D; Dielectric: X5R
C26-C28 = CAP_100nF_0402: 0402 100nF ±10% 16V X5R; PackageReference: 0402; MPN: GRM155R61C104KA88D; Voltage: 16V; Dielectric: X5R
C29 = CAP_68pF_0402: 0402 68pF ±5% 50V C0G; PackageReference: 0402; MPN: GRM1555C1H680JA01D; Voltage: 50V; Dielectric: C0G
C30-C33 = CAP_22uF_16V_1206: 1206 22uF ±10% 16V X5R; PackageReference: 1206; MPN: CL31A226KOHNNNE; Voltage: 16V; Dielectric: X5R
JP5 = 629105136821: Micro USB 2.0 Type B Receptacle WR-COM, Horizontal, SMT, with Pads and Pegs; Rated Current: 1 A; Contact Resistance: 30 mOhm; Working Voltage: 30 VAC; ComponentLink1Description: Manufacturer; ComponentLink1URL: http://www.we-online.de; ComponentLink2Description: Datasheet; ComponentLink2URL: https://katalog.we-online.de/em/datasheet/629105136821.pdf; Part Number: 629105136821; Published Date: September 2018; Publisher: Wurth Elektronik; Orientation: Horizontal; Connector Type: Micro USB 2.0 Type B; Operating Temperature: -40 to 105 degC; Mounting Technology: SMT; Gender: Receptacle; Packaging: Tape and Reel; MPN: 629105136821
L1 = L_4.7uH_6045: 6.0*6.0*4.5 4.7μH ±20% 5.50A DCR=0.034 SRF=24MHz; MPN: SWPA6045S4R7MT
LED1 = LED-BLUE-APA3010QBC/D-GX: LED BLUE; VALUE: BLUE; MPN: APA3010QBC/D-GX
Q1 = BC857: PNP,Vce=45V,Ic=0.1A,hfe=220~475; Manufacturer: Infineon; Ptot (max): 330Â mW; fT (typ): 250Â MHz; VCBO (max): 50Â V; ICM (max): 200Â mA; Green: TRUE; VCEO (max): 45Â V; VEBO (max): 5Â V; ICBO (max): 15Â nA; IC (max): 100Â mA; Packing: Reel; ComponentLink2Description: Datasheet; MPN: BC857B,215; PackageReference: SOT23; ComponentLink1URL: http://www.infineon.com/; IBM (max): 200Â mA; PackageDescription: 3-Pin Small Outline Transistor Package, 1.3 x 2.9 mm Body, 0.95 mm Pitch; ComponentLink3URL: http://www.infineon.com/dgdl/SOT23-Package_Overview.pdf?folderId=db3a30431936bc4b0119532290053c66&fileId=db3a30431936bc4b0119533468123c85; ComponentLink3Description: Package Specification; Mounting Technology: Surface Mount; ComponentLink1Description: Manufacturer URL; PackageVersion: Apr-08; Polarity: PNP; ComponentLink2URL: http://www.infineon.com/dgdl/bc857series_bc858series_bc859series_bc860series.pdf?folderId=db3a304314dca389011541d30fa21656&fileId=db3a304314dca389011541da0e3a1661
Q2 = SI2302: N-Channel Enhancement Mode Field-Effect Transistor, 20 V, 2.5 A, 3-Pin SOT23, Tape and Reel; Manufacturer: NXP Semiconductors; MPN: SI2302CDS-T1-GE3; Ciss [typ] (pF): 230; VDS [max] (V): 20; Channel Type: N; Coss [typ] (pF): 125; ID [max] (A): 2.5; Packing: Tape & Reel; DatasheetVersion: Rev. 02; PackageVersion: 06-03-16, 03/2006; Code_JEDEC: TO-236AB; ComponentLink3Description: Package Specification; ComponentLink2URL: http://www.nxp.com/documents/data_sheet/SI2302DS.pdf; PackageDescription: 3-Pin Small Outline Transistor Package, Body 2.9 x 1.3 mm, Pitch 0.95 mm; ComponentLink2Description: Datasheet; ComponentLink1Description: Manufacturer URL; Mounting Technology: Surface Mount; ComponentLink1URL: http://www.nxp.com/; ComponentLink3URL: http://www.nxp.com/documents/outline_drawing/sot023_po.pdf; PackageReference: SOT23
R20 R21 = RES_27R_0402: as R32 on sheet USBDAC; Tolerance: 1%; Value: 27R
R22 R47 = RES_120R_0402: 0402 120Ω ±1% 1/16W; MPN: RC0402FR-07120RL; Power: 62.5mW; Tolerance: 1%; Value: 120R
R23 = RES_49R9_0402: 0402 49.9Ω ±1% 1/16W; MPN: RC0402FR-0749R9L; Power: 62.5mW; Tolerance: 1%; Value: 49R9
R24 R25 = RES_10K5_0402: as R40 on sheet USBDAC; Tolerance: 1%; Value: 10K5
R26 = RES_100K_0402: 0402 100KΩ ±1% 1/16W; MPN: RC0402FR-07100KL; Power: 62.5mW; Tolerance: 1%; Value: 100K
R27 = RES_22K_0402: 0402 22KΩ ±1% 1/16W; MPN: RC0402FR-0722KL; Power: 62.5mW; Tolerance: 1%; Value: 22K
U3 = CPU-OM-O2SP: Onion Omega2S; MPN: OM-O2SP; Mouser: 353-OM-O2SP
U4 = IC-COM-USB-FT230XQ-SQ17: USB Bridge, USB to UART USB 2.0 UART Interface 16-QFN (4x4); MPN: FT230XQ-R
U5 = TPS54302DDCR: Buck Switching Regulator IC Positive Adjustable 0.596V 1 Output 3A SOT-23-6 Thin, TSOT-23-6; MPN: TPS54302DDCR

## Sheet SPDIF-RX.SchDoc
size A3
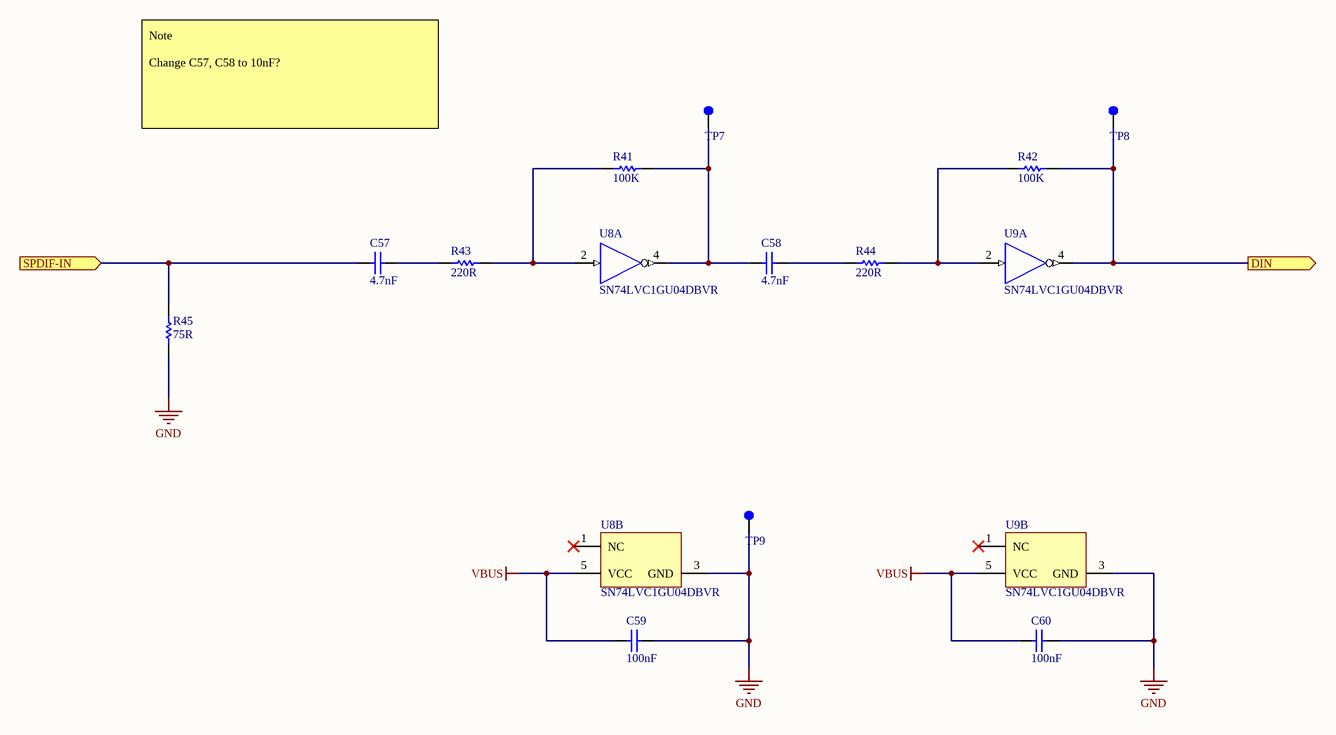
[diagram p4: SPDIF-RX.SchDoc]

### Parts
C57  value 4.7nF  [CAPC0402(1005)33_L]  (hidden comment: GRM155R71H472KA01D)
C58  value 4.7nF  [CAPC0402(1005)33_L]  (hidden comment: GRM155R71H472KA01D)
C59  value 100nF  [CAPC0402(1005)33_L]  (hidden comment: GRM155R61C104KA88D)
C60  value 100nF  [CAPC0402(1005)33_L]  (hidden comment: GRM155R61C104KA88D)
R41  100K  [RESC0402(1005)_L]
R42  100K  [RESC0402(1005)_L]
R43  220R  [RESC0402(1005)_L]
R44  220R  [RESC0402(1005)_L]
R45  75R  [RESC0805(2012)_L]
TP7  MECH_Testpoint  [MECH_TP_39_mil]  (value not drawn)  (no BOM)
TP8  MECH_Testpoint  [MECH_TP_39_mil]  (value not drawn)  (no BOM)
TP9  MECH_Testpoint  [MECH_TP_39_mil]  (value not drawn)  (no BOM)
U8  SN74LVC1GU04DBVR  [DBV0005A_N]  (parts A,B of 2)
U9  SN74LVC1GU04DBVR  [DBV0005A_N]  (parts A,B of 2)

### Ports
DIN (out), SPDIF-IN (in)

### Nets
GND: C59.2 C60.2 R45.1 TP9.1(Pin1) U8.3(GND) U9.3(GND)
VBUS: C59.1 C60.1 U8.5(VCC) U9.5(VCC)
DIN: R42.2 TP8.1(Pin1) U9.4(Y) ; port DIN
SPDIF-IN: C57.1 R45.2 ; port SPDIF-IN
NetC57_2: C57.2 R43.1
NetC58_1: C58.1 R41.2 TP7.1(Pin1) U8.4(Y)
NetC58_2: C58.2 R44.1
NetR41_1: R41.1 R43.2 U8.2(A)
NetR42_1: R42.1 R44.2 U9.2(A)

Not connected (* = marked no-connect by the designer): U8 1(NC)*; U9 1(NC)*

### Notes on the sheet
- Note
  Change C57, C58 to 10nF?

### Library data of the parts
C57 C58 = CAP_4.7nF_0402: 0402 4.7nF ±10% 50V X7R; PackageReference: 0402; MPN: GRM155R71H472KA01D; Voltage: 50V; Dielectric: X7R
C59 C60 = CAP_100nF_0402: 0402 100nF ±10% 16V X5R; PackageReference: 0402; MPN: GRM155R61C104KA88D; Voltage: 16V; Dielectric: X5R
R41 R42 = RES_100K_0402: as R26 on sheet OM-02P; Tolerance: 1%; Value: 100K
R43 R44 = RES_220R_0402: 0402 220Ω ±1% 1/16W; MPN: RC0402FR-07220RL; Power: 62.5mW; Tolerance: 1%; Value: 220R
R45 = RES_75R_0805: 0805 75Ω ±1% 1/8W; MPN: RC0805FR-0775RL; Power: 62.5mW; Tolerance: 1%; Value: 75R
TP7-TP9 = MECH_Testpoint: Testpoint
U8 U9 = CMP-0859-00178-1: Single Inverter Gate, DBV0005A, LARGE T&R; Logic: Inverting; Schmitt Trigger: No; Technology Family: LVC; ICC @ Nom Voltage(Max)(mA): 0.01; Rating: Catalog; Output Drive (IOL/IOH)(Max)(mA): 32/-32; VCC(Min)(V): 1.65; Voltage(Nom)(V): 1.8,2.5,3.3,5; tpd @ Nom Voltage(Max)(ns): 5.5,4.5,4.2,3.5; Sub-Family: Inverting Buffer/Driver; VCC(Max)(V): 5.5; F @ Nom Voltage(Max)(Mhz): 150; Output Type: CMOS; Input Type: CMOS/TTL; Bits(#): 1; PackageReference: DBV0005A; ComponentLink1URL: http://www.ti.com/; ComponentLink2Description: Datasheet; PartNumber: SN74LVC1GU04DBVR; ComponentLink2URL: http://www.ti.com/lit/ds/symlink/sn74lvc1gu04.pdf; 3-State Output: No; DatasheetVersion: SCES215V; Part Number: SN74LVC1GU04; ComponentLink1Description: Manufacturer URL; Operating Temperature Range(C): -40 to 125,-40 to 85; PartId: 1; MPN: SN74LVC1GU04DBVR

## Nets that join several sheets
GND: AirLP (14 pins), RIAA (10 pins), USBDAC (30 pins), OM-02P (23 pins), SPDIF-RX (6 pins)
VBUS: AirLP (JP4.1), USBDAC (R38.2 R46.2), OM-02P (6 pins), SPDIF-RX (C59.1 C60.1 U8.5 U9.5)
VCC: RIAA (C23.2 R10.1 R18.1 U2.8), USBDAC (12 pins)
AIN0L: AirLP (TP1.1), RIAA (C18.2), USBDAC (U6.12)
AIN0R: AirLP (TP2.1), RIAA (C7.2), USBDAC (U6.13)
D1_N: USBDAC (R33.1), OM-02P (U3.62)
D1_P: USBDAC (R29.1 R32.1), OM-02P (U3.61)
DIN: USBDAC (U6.24), SPDIF-RX (R42.2 TP8.1 U9.4)
MMINL: AirLP (JP1.3), RIAA (C19.1)
MMINR: AirLP (JP1.1), RIAA (C8.1)
MUTE: AirLP (SW3.1), USBDAC (U6.5)
SPDIF-IN: AirLP (JP4.3), SPDIF-RX (C57.1 R45.2)
SSPNDn: AirLP (R1.2 R2.2 R3.2), USBDAC (U1.16 U6.28)
VOL_DOWN: AirLP (SW2.1), USBDAC (U6.7)
VOL_UP: AirLP (SW1.1), USBDAC (U6.6)
VOUTL: AirLP (JP2.3 JP3.2), USBDAC (C35.2 R28.2 U1.12)
VOUTR: AirLP (JP2.1 JP3.3), USBDAC (C38.2 R34.2 U1.10)
WLEDn: AirLP (JP4.2), OM-02P (R47.1)

## Assembly variants
Seeed: not fitted JP1 JP2 JP3 JP4 JP5 SW1 SW2 SW3
THD: not fitted C1 C2 C3 C4 C5 C6 C7 C8 C9 C10 C11 C12 C13 C14 C15 C16 C17 C18 C19 C20 C21 C22 C23 C24 C25 C26 C27 C28 C29 C30 C31 C32 C33 C34 C35 C36 C37 C38 C39 C40 C41 C42 C43 C44 C45 C46 C47 C48 C49 C50 C51 C52 C53 C54 C55 C56 C57 C58 C59 C60 L1 LED1 Q1 Q2 R1 R2 R3 R4 R5 R6 R7 R8 R9 R10 R11 R12 R13 R14 R15 R16 R17 R18 R19 R20 R21 R22 R23 R24 R25 R26 R27 R28 R29 R30 R31 R32 R33 R34 R35 R36 R37 R38 R39 R40 R41 R42 R43 R44 R45 R46 R47 U1 U2 U3 U4 U5 U6 U7 U8 U9 Y1